# EAGLE design mbed_controller (EAGLE 5.11)
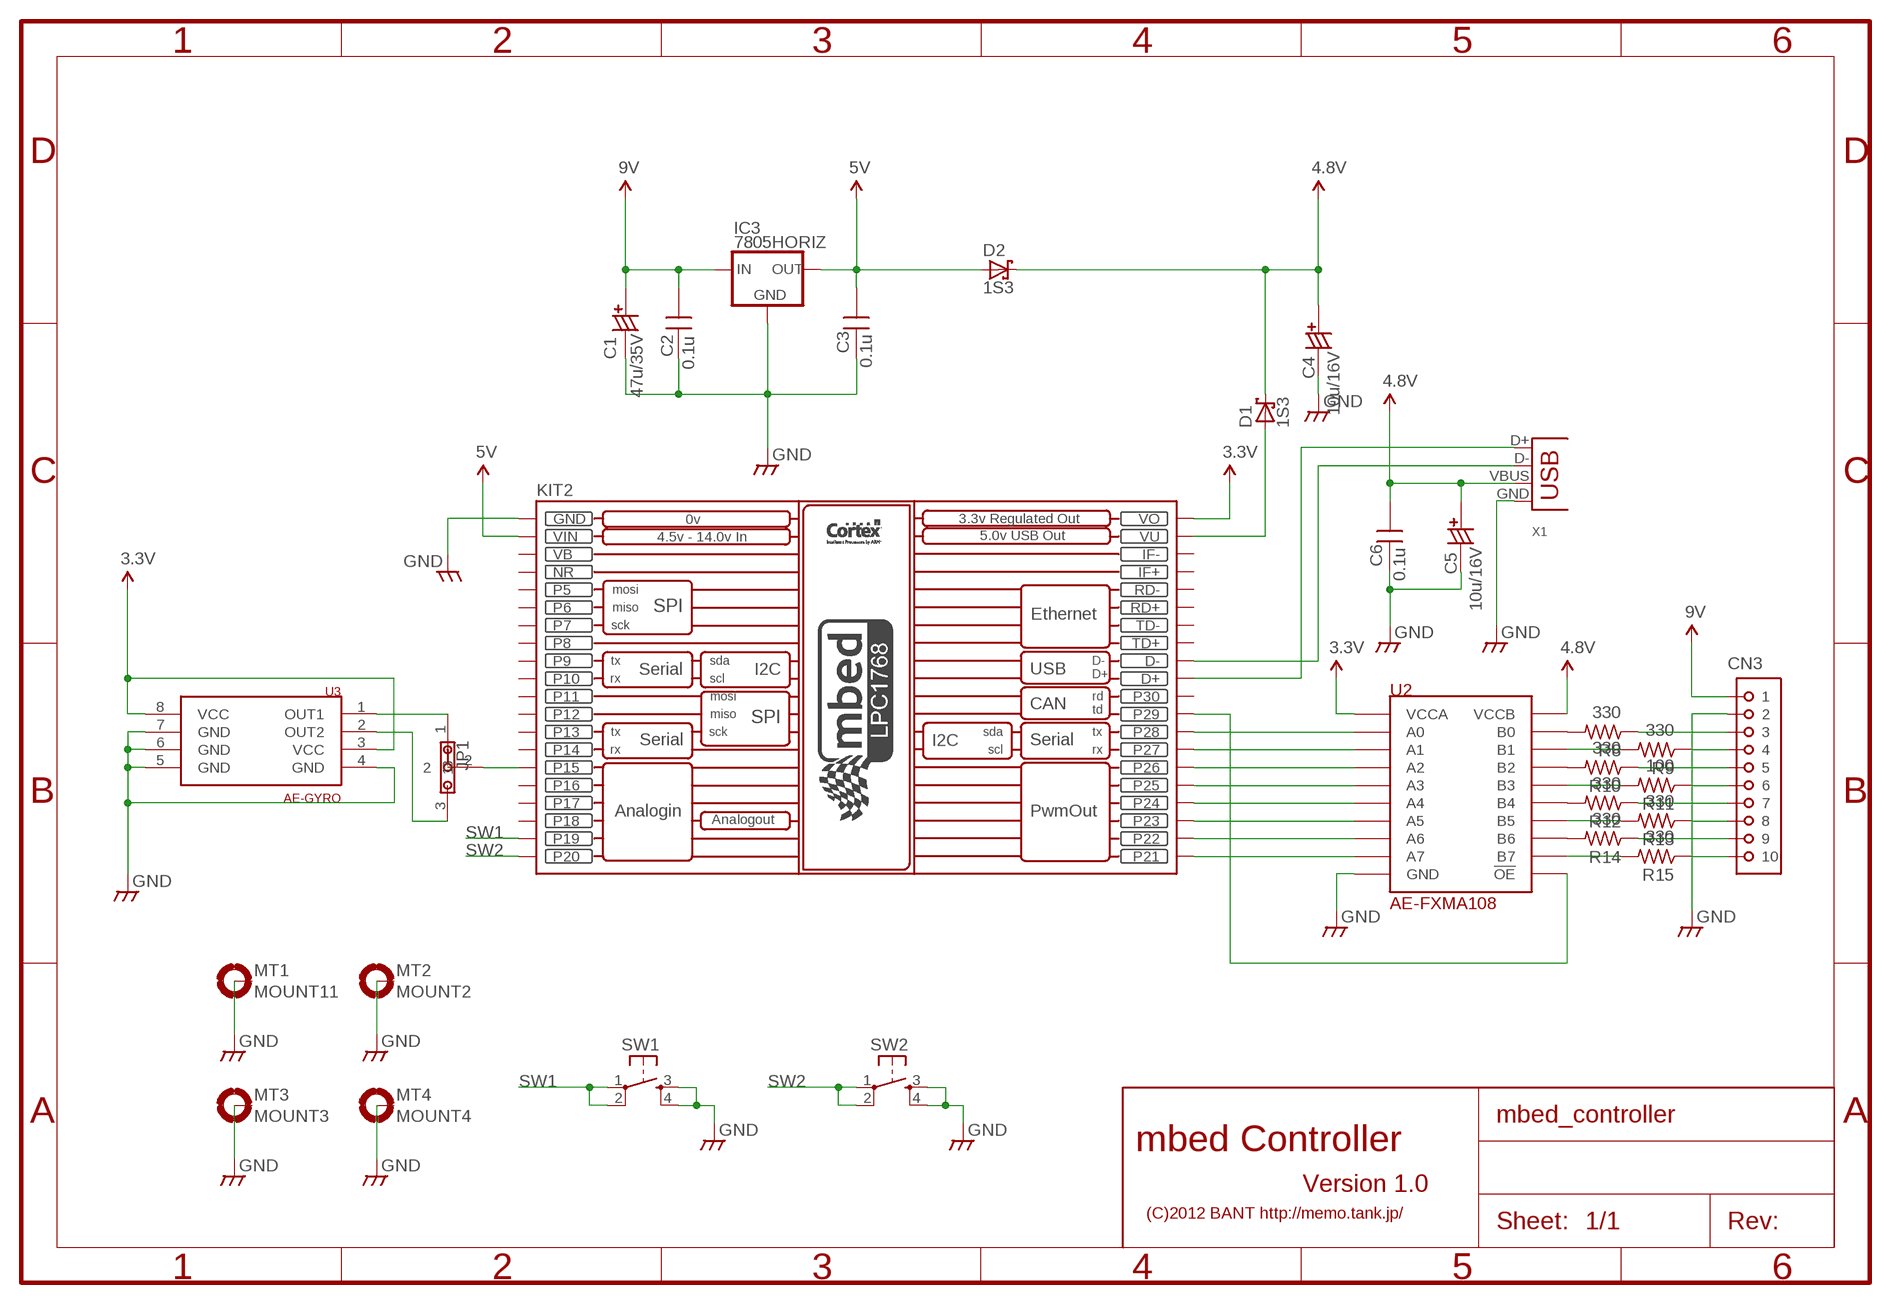
[diagram p0: schematic, sheet 1]

## Parts
C1  47u/35V  CCAP6.5  [CCAP_6.5]
C2  0.1u  CAPDIP_1  [CAP_DIP_1]
C3  0.1u  CAPDIP_1  [CAP_DIP_1]
C4  10u/16V  CCAP6.5  [CCAP_6.5]
C5  10u/16V  CCAP6.5  [CCAP_6.5]
C6  0.1u  CAPDIP_1  [CAP_DIP_1]
CN3  PSCON-10W  [PSCON-10-W]
D1  1S3  1N5818-B  [DO41-7.6]
D2  1S3  1N5818-B  [DO41-7.6]
IC3  7805HORIZ  [TO220H]
JP1  JUMPER_3P  [CSTLS]
KIT2  MBED_NXP_LPC1768  [MBED-KIT]
MT1  MOUNT11  MOUNT-PAD2.1  [PAD-2.1]
MT2  MOUNT2  MOUNT-PAD2.1  [PAD-2.1]
MT3  MOUNT3  MOUNT-PAD2.1  [PAD-2.1]
MT4  MOUNT4  MOUNT-PAD2.1  [PAD-2.1]
R8  330  R0.125W_3P  [R_0.125W_3]
R9  330  R0.125W_3P  [R_0.125W_3]
R10  330  R0.125W_3P  [R_0.125W_3]
R11  100  R0.125W_3P  [R_0.125W_3]
R12  330  R0.125W_3P  [R_0.125W_3]
R13  330  R0.125W_3P  [R_0.125W_3]
R14  330  R0.125W_3P  [R_0.125W_3]
R15  330  R0.125W_3P  [R_0.125W_3]
SW1  SW1  TACT-SWBIG  [SS-BIG_SWITCH]
SW2  SW2  TACT-SWBIG  [SS-BIG_SWITCH]
U2  AE-FXMA108  [AE-FXMA108]
U3  AE-GYRO  [AE-GYRO]
X1  USB-A-H  [USB-A-H]

## Nets
3.3V: KIT2.VOUT(VO) U2.VCCA U3.3(VCC) U3.8(VCC)
4.8V: C4.+ C5.+ C6.2 D1.C D2.C U2.VCCB X1.VBUS
5V: C3.2 D2.A IC3.3(OUT) KIT2.VIN
9V: C1.+ C2.2 CN3.P$1 IC3.1(IN)
GND: C1.- C2.1 C3.1 C4.- C5.- C6.1 CN3.P$2 IC3.2(GND) KIT2.GND MT1.B2,1(MOUNT) MT2.B2,1(MOUNT) MT3.B2,1(MOUNT) MT4.B2,1(MOUNT) SW1.3(S) SW1.4(S1) SW2.3(S) SW2.4(S1) U2.GND U3.4(GND) U3.5(GND) U3.6(GND) U3.7(GND) X1.GND
N$1: JP1.1 U3.1(OUT1)
N$2: JP1.3 U3.2(OUT2)
N$3: R8.2 U2.B0
N$4: JP1.2 KIT2.P$15(P15)
N$5: R9.2 U2.B1
N$6: R10.2 U2.B2
N$7: R12.2 U2.B4
N$8: R11.2 U2.B3
N$9: R13.2 U2.B5
N$10: R14.2 U2.B6
N$11: R15.2 U2.B7
N$12: KIT2.D- X1.D-
N$13: KIT2.D+ X1.D+
N$14: KIT2.P$21(P21) U2.A7
N$15: KIT2.P$22(P22) U2.A6
N$16: KIT2.P$23(P23) U2.A5
N$17: CN3.P$3 R8.1
N$18: CN3.P$4 R9.1
N$19: KIT2.P$24(P24) U2.A4
N$20: KIT2.P$25(P25) U2.A3
N$21: KIT2.P$26(P26) U2.A2
N$22: CN3.P$5 R10.1
N$23: KIT2.P$27(P27) U2.A1
N$24: CN3.P$6 R11.1
N$25: KIT2.P$28(P28) U2.A0
N$26: CN3.P$7 R12.1
N$27: KIT2.P$29(P29) U2.OE(!OE)
N$29: CN3.P$8 R13.1
N$31: CN3.P$9 R14.1
N$32: D1.A KIT2.VU
N$33: CN3.P$10 R15.1
SW1: KIT2.P$19(P19) SW1.1(P) SW1.2(P1)
SW2: KIT2.P$20(P20) SW2.1(P) SW2.2(P1)
Unconnected: KIT2.IF+ KIT2.IF- KIT2.P$5(P5) KIT2.P$6(P6) KIT2.P$7(P7) KIT2.P$8(P8) KIT2.P$9(P9) KIT2.P$10(P10) KIT2.P$11(P11) KIT2.P$12(P12) KIT2.P$13(P13) KIT2.P$14(P14) KIT2.P$16(P16) KIT2.P$17(P17) KIT2.P$18(P18) KIT2.P$30(P30) KIT2.RD+ KIT2.RD- KIT2.TD+ KIT2.TD-

## Notes on the sheet
- mbed Controller
- Version 1.0
- (C)2012 BANT http://memo.tank.jp/

## Power pins joined to a net without a drawn wire
NR: KIT2.NR
VB: KIT2.VB

## Library data of the parts
C1 C4 C5 = MyLib:CCAP: Polar capacitor
C2 C3 C6 = MyLib:CAP: Non polar capacitor
CN3 = bant:PSCON-10
D1 D2 = diode:1N581*: 1.0A SCHOTTKY BARRIER RECTIFIER Source: http://www.diodes.com/datasheets/ds23001.pdf
IC3 = MyLib:78*
JP1 = MyLib:JUMPER_3P: Jumper 3P
KIT2 = MBED_v2.1:MBED_NXP_LPC1768: Mbed LPC1768 - ARM CORTEX v2.1 * Schematic symbol is now placed in eagles's default raster. *The pads diameter are suitable for routing between mbed pins * mbed pads are 0.8 mm drill diameter. --------------------------------------------- Created by: Mohamed Yousry *Alexandria, Egypt *Email: mohamed.yousry@ieeegoldegypt.org
MT1-MT4 = MyLib:MOUNT-PAD: 2.1mm Mount Pad (Connectable to GND)
R8-R15 = MyLib:R: General Resiter 1/8W 1/4W 1/2W V/H
SW1 SW2 = bant:TACT-SW: Tacticle Push Switch
U2 = bant:AE-FXMA108
U3 = bant:AE-GYRO
X1 = con-usb:USB: USB Connectors

## Board
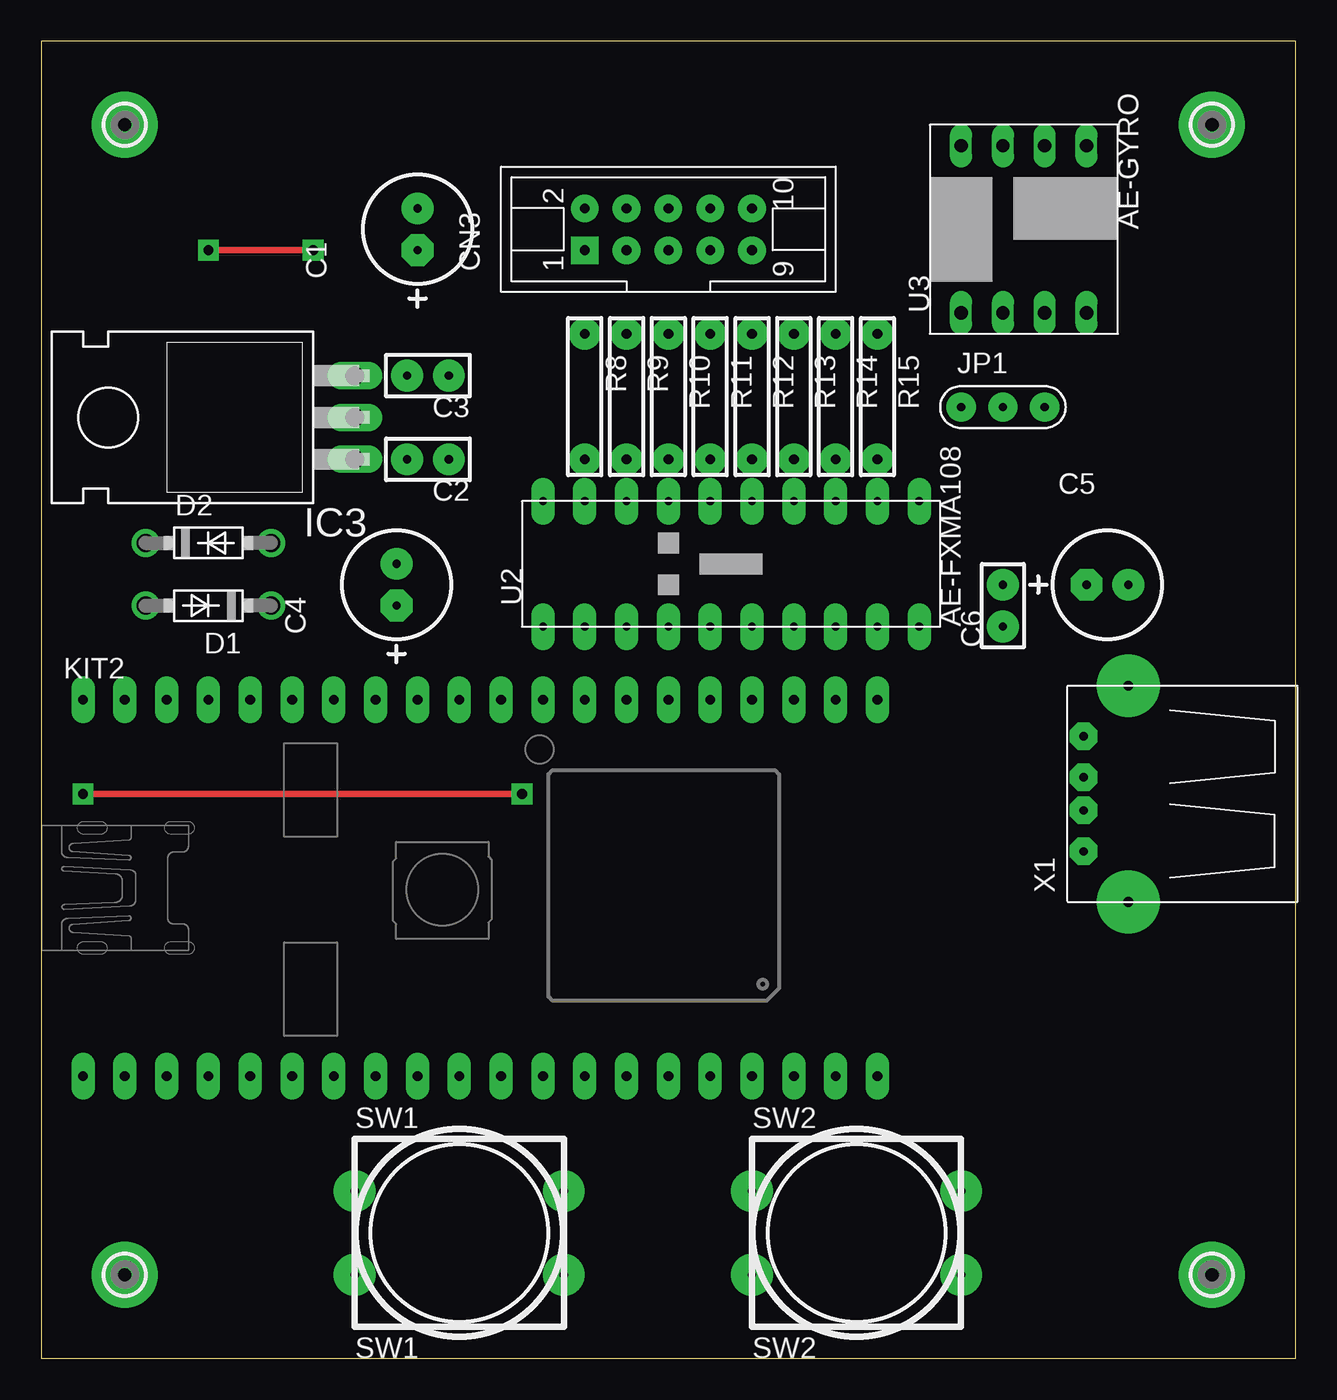
[diagram p1: board, top side]
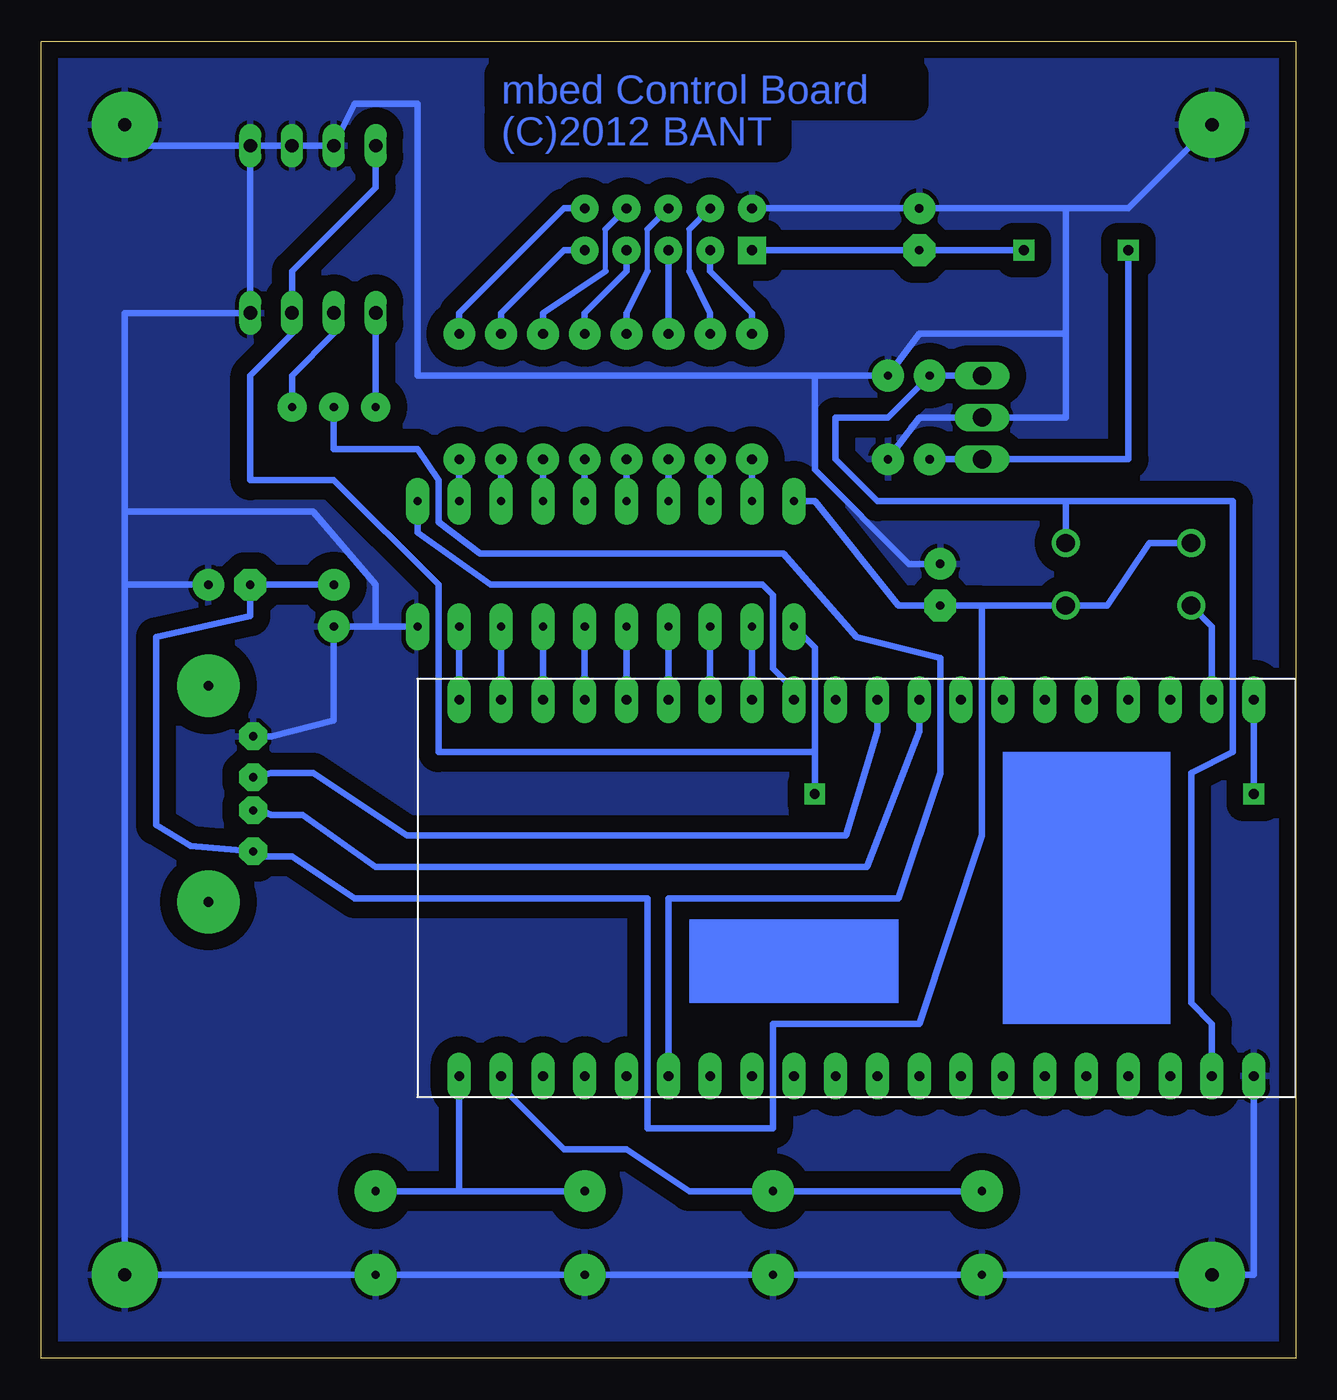
[diagram p2: board, bottom side, seen from below]

Size 76.2 x 80.01 mm. Coordinates in mm from the lower left corner, seen from the top.
Outline: 0,0 76.2,0 76.2,80.01 0,80.01 0,0
Copper layers (1*16): Top 0.035mm / dielectric 1.5mm / Bottom 0.035mm
Design rules "default": minimum track width 10mil, minimum drill 24mil, track to track 8mil, track to pad 8mil, pad to pad 8mil, via to via 8mil, smd to smd 8mil, copper to edge 40mil, drill to drill 8mil, minimum pad ring 10mil, minimum via ring 8mil, stop-mask expansion 4mil, vias tented up to drill 0mil, thermal gap 10mil

### Footprints (pad centres in the part's own frame; a part is rotated, then mirrored left to right if it is on the bottom)
CCAP_6.5 = drill 0.5 pad 1.93 octagon: + -1.27,0 | drill 0.5 pad 1.93 round: - 1.27,0
CAP_DIP_1 = drill 0.5 pad 1.93 round: 1 -1.27,0; 2 1.27,0
PSCON-10-W = drill 0.6 pad 1.676 square: P$1 -1.27,5.08 | drill 0.6 pad 1.676 round: P$2 1.27,5.08; P$3 -1.27,2.54; P$4 1.27,2.54; P$5 -1.27,0; P$6 1.27,0; P$7 -1.27,-2.54; P$8 1.27,-2.54; P$9 -1.27,-5.08; P$10 1.27,-5.08
DO41-7.6 = drill 1.1 pad 1.7 round: A 3.81,0; C -3.81,0
TO220H = drill 1.118 long: 1 -2.54,-7.62; 2 0,-7.62; 3 2.54,-7.62
CSTLS = drill 0.5 pad 1.778 round: 1 -2.54,0; 2 0,0; 3 2.54,0
MBED-KIT = drill 0.6 pad 1.422 long: D+ 11.43,1.27; D- 11.43,3.81; GND -11.43,24.13; IF+ 11.43,16.51; IF- 11.43,19.05; NR -11.43,16.51; P$5 -11.43,13.97; P$6 -11.43,11.43; P$7 -11.43,8.89; P$8 -11.43,6.35; P$9 -11.43,3.81; P$10 -11.43,1.27; P$11 -11.43,-1.27; P$12 -11.43,-3.81; P$13 -11.43,-6.35; P$14 -11.43,-8.89; P$15 -11.43,-11.43; P$16 -11.43,-13.97; P$17 -11.43,-16.51; P$18 -11.43,-19.05; P$19 -11.43,-21.59; P$20 -11.43,-24.13; P$21 11.43,-24.13; P$22 11.43,-21.59; P$23 11.43,-19.05; P$24 11.43,-16.51; P$25 11.43,-13.97; P$26 11.43,-11.43; P$27 11.43,-8.89; P$28 11.43,-6.35; P$29 11.43,-3.81; P$30 11.43,-1.27; RD+ 11.43,11.43; RD- 11.43,13.97; TD+ 11.43,6.35; TD- 11.43,8.89; VB -11.43,19.05; VIN -11.43,21.59; VOUT 11.43,24.13; VU 11.43,21.59
PAD-2.1 = drill 0.8 pad 4 round: B2,1 0,0
R_0.125W_3 = drill 0.6 pad 1.93 round: 1 -3.81,0; 2 3.81,0
SS-BIG_SWITCH = drill 0.5 pad 2.54 round: 1 0,10.16; 2 12.7,10.16; 3 0,5.08; 4 12.7,5.08
AE-FXMA108 = drill 0.5 pad 1.422 long: A0 -3.81,8.89; A1 -3.81,6.35; A2 -3.81,3.81; A3 -3.81,1.27; A4 -3.81,-1.27; A5 -3.81,-3.81; A6 -3.81,-6.35; A7 -3.81,-8.89; B0 3.81,8.89; B1 3.81,6.35; B2 3.81,3.81; B3 3.81,1.27; B4 3.81,-1.27; B5 3.81,-3.81; B6 3.81,-6.35; B7 3.81,-8.89; GND -3.81,-11.43; OE 3.81,-11.43; VCCA -3.81,11.43; VCCB 3.81,11.43
AE-GYRO = drill 0.813 long: 1 -5.08,3.81; 2 -5.08,1.27; 3 -5.08,-1.27; 4 -5.08,-3.81; 5 5.08,-3.81; 6 5.08,-1.27; 7 5.08,1.27; 8 5.08,3.81
USB-A-H = drill 0.5 pad 1.676 octagon: D+ 2.718,-1.003; D- 2.718,1.003; GND 2.718,-3.493; VBUS 2.718,3.493 | drill 0.6 pad 3.81 round: P$5 0,-6.566; P$6 0,6.566

### Placement (x,y rotation side)
C1  22.86,68.58 90 top
C2  23.5,54.61 180 top
C3  23.5,59.69 180 top
C4  21.59,46.99 90 top
C5  64.77,46.99 0 top
C6  58.42,45.72 90 top
CN3  38.1,68.58 90 top
D1  10.16,45.72 180 top
D2  10.16,49.53 0 top
IC3  11.43,57.15 90 top
JP1  58.42,57.78 0 top
KIT2  26.67,28.57 90 top
MT1  5.08,74.93 0 top
MT2  71.12,74.93 0 top
MT3  71.12,5.08 0 top
MT4  5.08,5.08 0 top
R8  33.02,58.42 270 top
R9  35.56,58.42 270 top
R10  38.1,58.42 270 top
R11  40.64,58.42 270 top
R12  43.18,58.42 270 top
R13  45.72,58.42 270 top
R14  48.26,58.42 270 top
R15  50.8,58.42 270 top
SW1  19.05,0 0 top
SW2  43.18,0 0 top
U2  41.91,48.26 90 top
U3  59.69,68.58 90 top
X1  66.04,34.29 180 top

### Tracks (layer width: path | path; a pad name or v marks a point on that pad's centre or on a via)
3.3V  (via drill 0.6 pad 1.27)
  Top 0.406: v2.54,34.29 v29.21,34.29
  Bottom 0.406: U3.8 55.88,71.12 60.96,66.04 U3.3 60.96,62.23 63.5,59.69 63.5,53.34 58.42,53.34 52.07,46.99 52.07,36.83 29.21,36.83 | U2.VCCA 29.21,43.18 29.21,36.83 | v29.21,34.29 29.21,36.83 | v2.54,34.29 KIT2.VOUT
4.8V
  Bottom 0.406: D2.C 8.89,49.53 11.43,45.72 D1.C 19.05,45.72 | C6.2 C5.+ 63.5,45.09 69.22,43.81 69.22,32.38 67.13,31.11 X1.VBUS 62.87,30.48 60.96,30.48 57.15,27.94 39.37,27.94 39.37,13.97 31.75,13.97 31.75,20.32 22.86,20.32 19.05,31.75 19.05,45.72 | U2.VCCB 29.21,52.07 24.13,45.72 C4.+ 19.05,45.72
5V
  Bottom 0.406: IC3.3 C3.2 24.77,57.15 27.94,57.15 27.94,54.61 25.4,52.07 13.97,52.07 | 13.97,52.07 D2.A | 13.97,52.07 3.81,52.07 3.81,36.83 6.35,35.56 6.35,21.59 5.08,20.32 KIT2.VIN
9V  (via drill 0.6 pad 1.27)
  Top 0.406: v10.16,67.31 v16.51,67.31
  Bottom 0.406: CN3.P$1 C1.+ v16.51,67.31 | C2.2 IC3.1 10.16,54.61 v10.16,67.31
GND
  Bottom 0.406: KIT2.GND 2.54,5.08 MT4.B2,1 SW1.3 SW1.4 SW2.3 SW2.4 MT3.B2,1 71.12,46.99 | C4.- 23.5,48.26 29.21,53.98 29.21,59.69 | 29.21,59.69 C3.1 22.86,62.23 13.97,62.23 | C2.1 22.86,57.15 IC3.2 13.97,57.15 13.97,62.23 | CN3.P$2 C1.- 13.97,69.85 | 13.97,62.23 13.97,69.85 | MT1.B2,1 10.16,69.85 13.97,69.85 | 55.88,44.45 C6.1 58.42,38.73 62.23,37.78 X1.GND | 55.88,44.45 U2.GND | U3.5 U3.4 71.12,63.5 71.12,51.44 | U3.5 U3.6 U3.7 57.15,76.2 53.34,76.2 53.34,59.69 29.21,59.69 | MT2.B2,1 69.85,73.66 U3.5 | 55.88,44.45 55.88,46.99 59.69,51.44 71.12,51.44 | 71.12,46.99 71.12,51.44 | 71.12,46.99 C5.-
  pour Bottom (isolate 1.016): 0,80.01 0,0 76.2,0 76.2,80.01
N$1
  Bottom 0.406: JP1.1 U3.1
N$2
  Bottom 0.406: U3.2 58.42,62.23 60.96,59.69 JP1.3
N$3
  Bottom 0.406: U2.B0 R8.2
N$4
  Bottom 0.406: JP1.2 58.42,55.24 53.34,55.24 52.07,53.34 52.07,50.8 49.53,48.9 31.11,48.9 26.67,43.81 21.59,42.55 21.59,35.56 24.13,27.94 38.1,27.94 KIT2.P$15
N$5
  Bottom 0.406: U2.B1 R9.2
N$6
  Bottom 0.406: U2.B2 R10.2
N$7
  Bottom 0.406: U2.B4 R12.2
N$8
  Bottom 0.406: U2.B3 R11.2
N$9
  Bottom 0.406: U2.B5 R13.2
N$10
  Bottom 0.406: U2.B6 R14.2
N$11
  Bottom 0.406: U2.B7 R15.2
N$12
  Bottom 0.406: KIT2.D- 22.86,38.1 26.04,29.84 55.88,29.84 60.33,33.02 62.23,33.02 62.87,33.29 X1.D-
N$13
  Bottom 0.406: KIT2.D+ 25.4,38.1 27.3,31.75 53.98,31.75 59.69,35.56 62.23,35.56 X1.D+
N$14
  Bottom 0.406: KIT2.P$21 U2.A7
N$15
  Bottom 0.406: KIT2.P$22 U2.A6
N$16
  Bottom 0.406: KIT2.P$23 U2.A5
N$17
  Bottom 0.406: CN3.P$3 35.56,66.04 33.02,63.5 R8.1
N$18
  Bottom 0.305: 36.83,66.04 36.83,68.58
  Bottom 0.406: 36.83,68.58 CN3.P$4 | R9.1 35.56,63.5 36.83,66.04
N$19
  Bottom 0.406: KIT2.P$24 U2.A4
N$20
  Bottom 0.406: KIT2.P$25 U2.A3
N$21
  Bottom 0.406: KIT2.P$26 U2.A2
N$22
  Bottom 0.406: R10.1 CN3.P$5
N$23
  Bottom 0.406: KIT2.P$27 U2.A1
N$24
  Bottom 0.305: 39.37,66.04 39.37,68.58
  Bottom 0.406: 39.37,68.58 CN3.P$6 | R11.1 40.64,63.5 39.37,66.04
N$25
  Bottom 0.406: KIT2.P$28 U2.A0
N$26
  Bottom 0.406: CN3.P$7 40.64,66.04 43.18,63.5 R12.1
N$27
  Bottom 0.406: U2.OE 53.34,50.16 48.9,46.99 32.38,46.99 31.75,46.35 31.75,41.91 30.48,40.64 KIT2.P$29
N$29
  Bottom 0.305: 41.91,66.04 41.91,68.58
  Bottom 0.406: 41.91,68.58 CN3.P$8 | R13.1 45.72,63.5 41.91,66.04
N$31
  Bottom 0.406: CN3.P$9 44.45,67.31 48.26,63.5 R14.1
N$32
  Bottom 0.406: KIT2.VU 5.08,44.45 D1.A
N$33
  Bottom 0.406: CN3.P$10 44.45,69.85 50.8,63.5 R15.1
SW1
  Bottom 0.254: 48.26,16.51 KIT2.P$19
  Bottom 0.406: 48.26,16.51 44.45,12.7 40.64,12.7 36.83,10.16 SW1.2 SW1.1
SW2
  Bottom 0.406: SW2.1 50.8,10.16 | 50.8,10.16 SW2.2 | 50.8,10.16 KIT2.P$20
(copper drawn outside any net)
  shapes: Bottom area x2

### Text on the board
Bottom: mbed Control Board | (C)2012 BANT